# Altium schematic sheet DRVLED.SchDoc
size A4; Organization: Altium Limited; Address1: L3, 12a Rodborough Rd; Address2: Frenchs Forest; Address3: NSW; Address4: Australia 2086
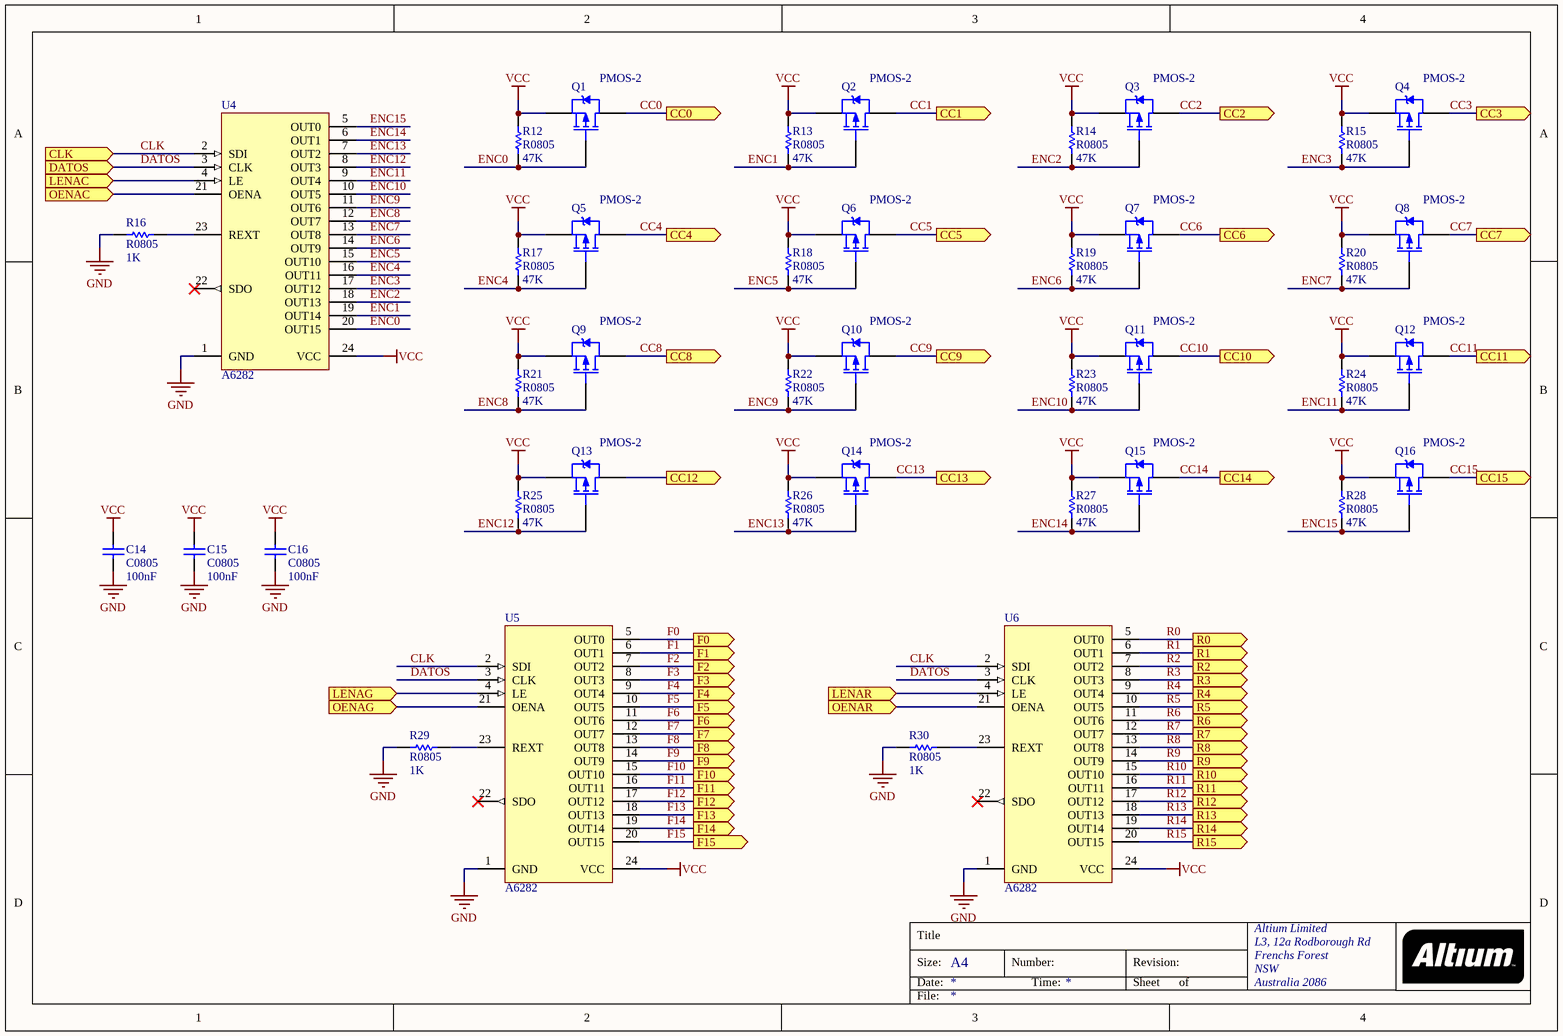
[diagram p0: DRVLED.SchDoc]

## Parts
C14  C0805  value 100nF  [C0805C]
C15  C0805  value 100nF  [C0805C]
C16  C0805  value 100nF  [C0805C]
Q1  PMOS-2  [SOT23MOS]
Q2  PMOS-2  [SOT23MOS]
Q3  PMOS-2  [SOT23MOS]
Q4  PMOS-2  [SOT23MOS]
Q5  PMOS-2  [SOT23MOS]
Q6  PMOS-2  [SOT23MOS]
Q7  PMOS-2  [SOT23MOS]
Q8  PMOS-2  [SOT23MOS]
Q9  PMOS-2  [SOT23MOS]
Q10  PMOS-2  [SOT23MOS]
Q11  PMOS-2  [SOT23MOS]
Q12  PMOS-2  [SOT23MOS]
Q13  PMOS-2  [SOT23MOS]
Q14  PMOS-2  [SOT23MOS]
Q15  PMOS-2  [SOT23MOS]
Q16  PMOS-2  [SOT23MOS]
R12  R0805  value 47K  [R0805]
R13  R0805  value 47K  [R0805]
R14  R0805  value 47K  [R0805]
R15  R0805  value 47K  [R0805]
R16  R0805  value 1K  [R0805]
R17  R0805  value 47K  [R0805]
R18  R0805  value 47K  [R0805]
R19  R0805  value 47K  [R0805]
R20  R0805  value 47K  [R0805]
R21  R0805  value 47K  [R0805]
R22  R0805  value 47K  [R0805]
R23  R0805  value 47K  [R0805]
R24  R0805  value 47K  [R0805]
R25  R0805  value 47K  [R0805]
R26  R0805  value 47K  [R0805]
R27  R0805  value 47K  [R0805]
R28  R0805  value 47K  [R0805]
R29  R0805  value 1K  [R0805]
R30  R0805  value 1K  [R0805]
U4  A6282  [SOP24]
U5  A6282  [SOP24]
U6  A6282  [SOP24]

## Ports
CC0 (out), CC1 (out), CC2 (out), CC3 (out), CC4 (out), CC5 (out), CC6 (out), CC7 (out), CC8 (out), CC9 (out), CC10 (out), CC11 (out), CC12 (out), CC13 (out), CC14 (out), CC15 (out), CLK (in), DATOS (in), F0 (out), F1 (out), F2 (out), F3 (out), F4 (out), F5 (out), F6 (out), F7 (out), F8 (out), F9 (out), F10 (out), F11 (out), F12 (out), F13 (out), F14 (out), F15 (out), LENAC (in), LENAG (in), LENAR (in), OENAC (in), OENAG (in), OENAR (in), R0 (out), R1 (out), R2 (out), R3 (out), R4 (out), R5 (out), R6 (out), R7 (out), R8 (out), R9 (out), R10 (out), R11 (out), R12 (out), R13 (out), R14 (out), R15 (out)

## Nets
GND: C14.1 C15.1 C16.1 R16.1 R29.1 R30.1 U4.1(GND) U5.1(GND) U6.1(GND)
VCC: C14.2 C15.2 C16.2 Q1.3(S) Q2.3(S) Q3.3(S) Q4.3(S) Q5.3(S) Q6.3(S) Q7.3(S) Q8.3(S) Q9.3(S) Q10.3(S) Q11.3(S) Q12.3(S) Q13.3(S) Q14.3(S) Q15.3(S) Q16.3(S) R12.2 R13.2 R14.2 R15.2 R17.2 R18.2 R19.2 R20.2 R21.2 R22.2 R23.2 R24.2 R25.2 R26.2 R27.2 R28.2 U4.24(VCC) U5.24(VCC) U6.24(VCC)
CC0: Q1.2(D) ; port CC0
CC1: Q2.2(D) ; port CC1
CC2: Q3.2(D) ; port CC2
CC3: Q4.2(D) ; port CC3
CC4: Q5.2(D) ; port CC4
CC5: Q6.2(D) ; port CC5
CC6: Q7.2(D) ; port CC6
CC7: Q8.2(D) ; port CC7
CC8: Q9.2(D) ; port CC8
CC9: Q10.2(D) ; port CC9
CC10: Q11.2(D) ; port CC10
CC11: Q12.2(D) ; port CC11
CC12: Q13.2(D) ; port CC12
CC13: Q14.2(D) ; port CC13
CC14: Q15.2(D) ; port CC14
CC15: Q16.2(D) ; port CC15
CLK: U4.2(SDI) U5.2(SDI) U6.2(SDI) ; port CLK
DATOS: U4.3(CLK) U5.3(CLK) U6.3(CLK) ; port DATOS
ENC0: Q1.1(G) R12.1 U4.20(OUT15)
ENC1: Q2.1(G) R13.1 U4.19(OUT14)
ENC2: Q3.1(G) R14.1 U4.18(OUT13)
ENC3: Q4.1(G) R15.1 U4.17(OUT12)
ENC4: Q5.1(G) R17.1 U4.16(OUT11)
ENC5: Q6.1(G) R18.1 U4.15(OUT10)
ENC6: Q7.1(G) R19.1 U4.14(OUT9)
ENC7: Q8.1(G) R20.1 U4.13(OUT8)
ENC8: Q9.1(G) R21.1 U4.12(OUT7)
ENC9: Q10.1(G) R22.1 U4.11(OUT6)
ENC10: Q11.1(G) R23.1 U4.10(OUT5)
ENC11: Q12.1(G) R24.1 U4.9(OUT4)
ENC12: Q13.1(G) R25.1 U4.8(OUT3)
ENC13: Q14.1(G) R26.1 U4.7(OUT2)
ENC14: Q15.1(G) R27.1 U4.6(OUT1)
ENC15: Q16.1(G) R28.1 U4.5(OUT0)
F0: U5.5(OUT0) ; port F0
F1: U5.6(OUT1) ; port F1
F2: U5.7(OUT2) ; port F2
F3: U5.8(OUT3) ; port F3
F4: U5.9(OUT4) ; port F4
F5: U5.10(OUT5) ; port F5
F6: U5.11(OUT6) ; port F6
F7: U5.12(OUT7) ; port F7
F8: U5.13(OUT8) ; port F8
F9: U5.14(OUT9) ; port F9
F10: U5.15(OUT10) ; port F10
F11: U5.16(OUT11) ; port F11
F12: U5.17(OUT12) ; port F12
F13: U5.18(OUT13) ; port F13
F14: U5.19(OUT14) ; port F14
F15: U5.20(OUT15) ; port F15
LENAC: U4.4(LE) ; port LENAC
LENAG: U5.4(LE) ; port LENAG
LENAR: U6.4(LE) ; port LENAR
OENAC: U4.21(OENA) ; port OENAC
OENAG: U5.21(OENA) ; port OENAG
OENAR: U6.21(OENA) ; port OENAR
R0: U6.5(OUT0) ; port R0
R1: U6.6(OUT1) ; port R1
R2: U6.7(OUT2) ; port R2
R3: U6.8(OUT3) ; port R3
R4: U6.9(OUT4) ; port R4
R5: U6.10(OUT5) ; port R5
R6: U6.11(OUT6) ; port R6
R7: U6.12(OUT7) ; port R7
R8: U6.13(OUT8) ; port R8
R9: U6.14(OUT9) ; port R9
R10: U6.15(OUT10) ; port R10
R11: U6.16(OUT11) ; port R11
R12: U6.17(OUT12) ; port R12
R13: U6.18(OUT13) ; port R13
R14: U6.19(OUT14) ; port R14
R15: U6.20(OUT15) ; port R15
NetR16_2: R16.2 U4.23(REXT)
NetR29_2: R29.2 U5.23(REXT)
NetR30_2: R30.2 U6.23(REXT)

Not connected (* = marked no-connect by the designer): U4 22(SDO)*; U5 22(SDO)*; U6 22(SDO)*

## Notes on the sheet
- Title
- Size:
- Date:
- A4
- Number:
- Time:
- Revision:
- Sheet
- of
- File:

## Library data of the parts
C14-C16 = Cap 0805 100nF: Cap 100nF 25V X7R; Part: 399-1170-1-ND; Proveedor: Digikey; Published: 8-Jun-2000; LatestRevisionDate: 17-Jul-2002; LatestRevisionNote: Re-released for DXP Platform.; PackageReference: C1206; Publisher: Altium Limited; Price: 0.10
Q1-Q16 = PMOS-2: P-Channel Power MOSFET; Note: Pin 4 not drawn and electrically connected to Pin 2.; Published: 8-Jun-2000; LatestRevisionDate: 17-Jul-2002; LatestRevisionNote: Re-released for DXP Platform.; DatasheetDocument: PD-9.390D; PackageReference: TO-220AB; Publisher: Altium Limited; Code_JEDEC: TO-220-AB; ComponentLink1Description: Manufacturer Link; ComponentLink1URL: http://www.irf.com/
R12-R15 R17-R28 = Res 0805 47K: Semiconductor Resistor; Part: 311-47KARCT-ND; Proveedor: Digikey; Published: 8-Jun-2000; LatestRevisionDate: 17-Jul-2002; LatestRevisionNote: Re-released for DXP Platform.; PackageReference: AXIAL-0.5; Publisher: Altium Limited; Price: 0.1
R16 R29 R30 = Res 0805 1K: Semiconductor Resistor; Part: 311-1.0KARCT-ND; Proveedor: Digikey; Published: 8-Jun-2000; LatestRevisionDate: 17-Jul-2002; LatestRevisionNote: Re-released for DXP Platform.; PackageReference: AXIAL-0.5; Publisher: Altium Limited; Price: 0.1
U4-U6 = A6282: 16 Bit Current Constant Driver; Manufacturer: Allegro; Class I: Interface; Published: 16 Enero 2004; Revision: July-2002: Re-released for DXP Platform.; Datasheet: Latest Revision: Sep-1998; Package Reference: DIP18; Publisher: Fernando Vasquez; Class II: Current Constant Driver